# Altium schematic sheet CPLD.SchDoc: {Наименование}
size 420 x 297 mm; DocumentNumber: НРДЦ.ХХХХХХ.ХХХ ХХ; SheetNumber: {}; SheetTotal: {}; PageSetup: Record=PageOptions|CenterHorizontal=False|CenterVertical=False|PrintScale=0.95|XCorrection=0.00|YCorrection=0.00|PrintKind=1|BorderSize=5000000|LeftOffset=0|BottomOffset=0|Orientation=1|PaperLength=1000|PaperWidth=1000|Scale=100|PaperSource=15|PrintQuality=600|MediaType=1|DitherType=10|PaperKind=A4|PrintScaleMode=1; Rule: PcbType=ProtelPcb
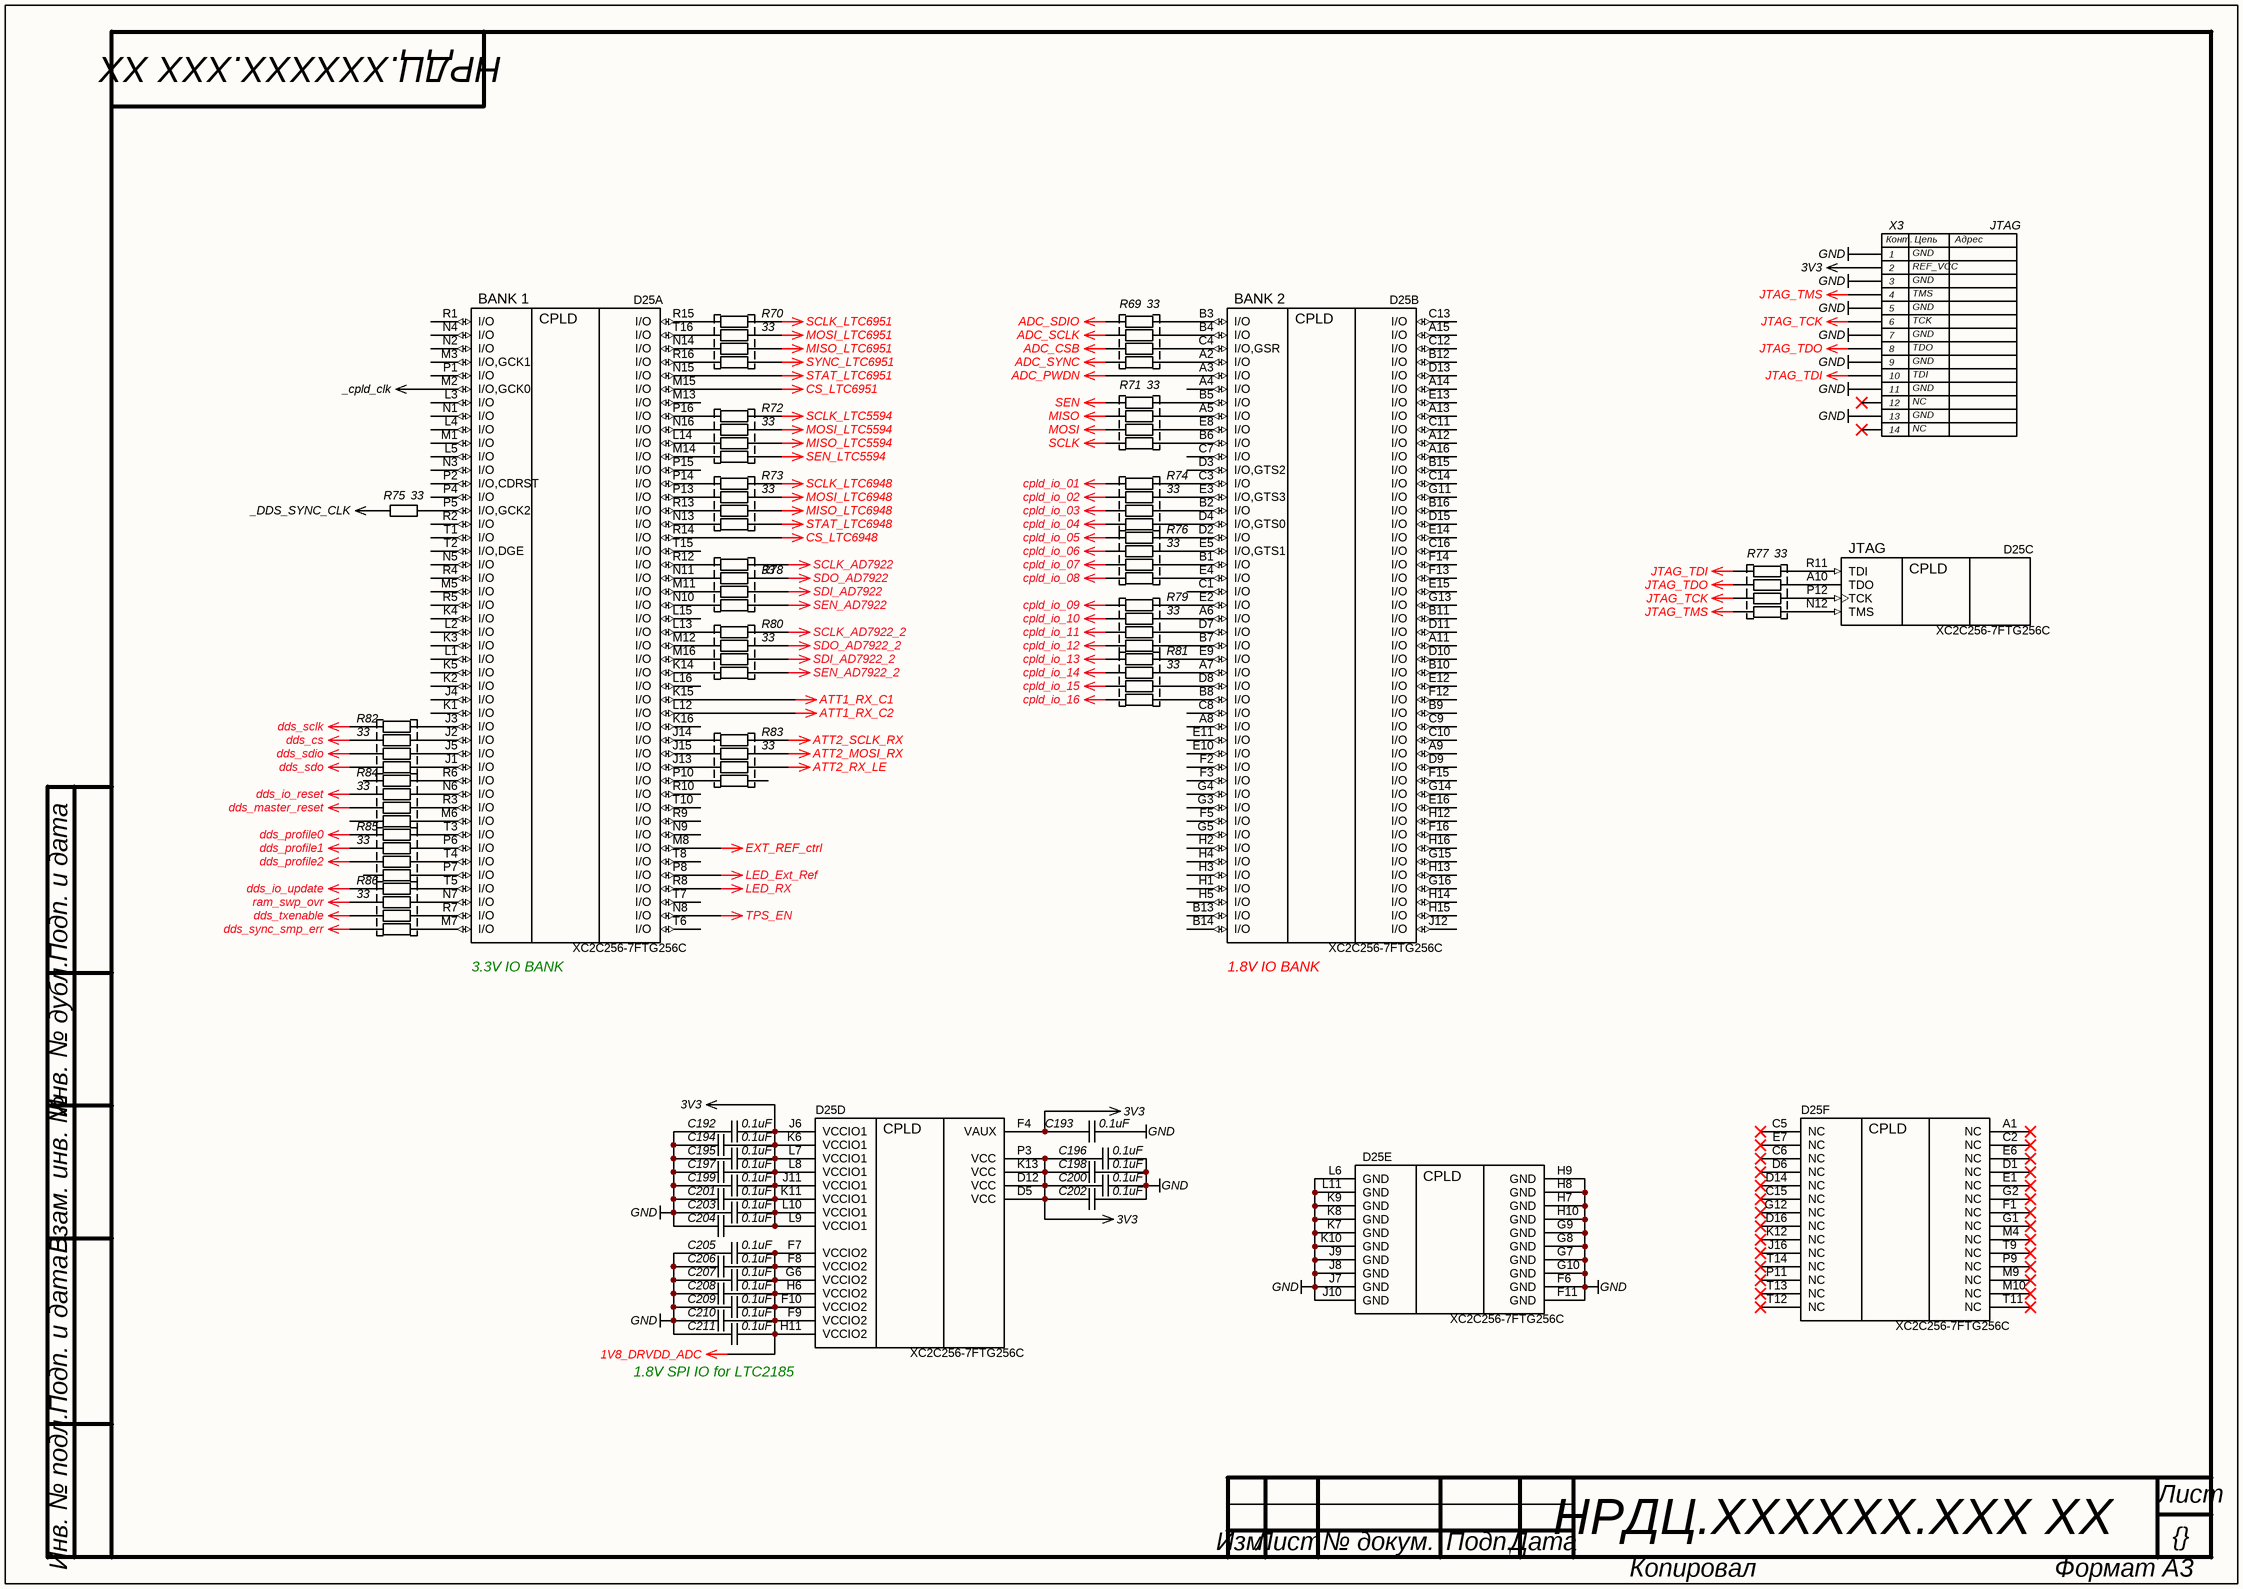
[diagram p0: CPLD.SchDoc]

## Parts
C192  value 0.1uF  [C0402]  (hidden comment: CAP)
C193  value 0.1uF  [C0402]  (hidden comment: CAP)
C194  value 0.1uF  [C0402]  (hidden comment: CAP)
C195  value 0.1uF  [C0402]  (hidden comment: CAP)
C196  value 0.1uF  [C0402]  (hidden comment: CAP)
C197  value 0.1uF  [C0402]  (hidden comment: CAP)
C198  value 0.1uF  [C0402]  (hidden comment: CAP)
C199  value 0.1uF  [C0402]  (hidden comment: CAP)
C200  value 0.1uF  [C0402]  (hidden comment: CAP)
C201  value 0.1uF  [C0402]  (hidden comment: CAP)
C202  value 0.1uF  [C0402]  (hidden comment: CAP)
C203  value 0.1uF  [C0402]  (hidden comment: CAP)
C204  value 0.1uF  [C0402]  (hidden comment: CAP)
C205  value 0.1uF  [C0402]  (hidden comment: CAP)
C206  value 0.1uF  [C0402]  (hidden comment: CAP)
C207  value 0.1uF  [C0402]  (hidden comment: CAP)
C208  value 0.1uF  [C0402]  (hidden comment: CAP)
C209  value 0.1uF  [C0402]  (hidden comment: CAP)
C210  value 0.1uF  [C0402]  (hidden comment: CAP)
C211  value 0.1uF  [C0402]  (hidden comment: CAP)
D25  XC2C256-7FTG256C  [FTG256]  (parts A,B,C,D,E,F of 6)
R69  value 33  [EXN8V]  (hidden comment: RES 4x0402)
R70  value 33  [EXN8V]  (hidden comment: RES 4x0402)
R71  value 33  [EXN8V]  (hidden comment: RES 4x0402)
R72  value 33  [EXN8V]  (hidden comment: RES 4x0402)
R73  value 33  [EXN8V]  (hidden comment: RES 4x0402)
R74  value 33  [EXN8V]  (hidden comment: RES 4x0402)
R75  value 33  [R0402]  (hidden comment: RES)
R76  value 33  [EXN8V]  (hidden comment: RES 4x0402)
R77  value 33  [EXN8V]  (hidden comment: RES 4x0402)
R78  value 33  [EXN8V]  (hidden comment: RES 4x0402)
R79  value 33  [EXN8V]  (hidden comment: RES 4x0402)
R80  value 33  [EXN8V]  (hidden comment: RES 4x0402)
R81  value 33  [EXN8V]  (hidden comment: RES 4x0402)
R82  value 33  [EXN8V]  (hidden comment: RES 4x0402)
R83  value 33  [EXN8V]  (hidden comment: RES 4x0402)
R84  value 33  [EXN8V]  (hidden comment: RES 4x0402)
R85  value 33  [EXN8V]  (hidden comment: RES 4x0402)
R86  value 33  [EXN8V]  (hidden comment: RES 4x0402)
X3  JTAG  [JTAG Mail 2mm]

## Nets
1V8_DRVDD_ADC: C205.2 C206.2 C207.2 C208.2 C209.2 C210.2 C211.2 D25.F7(VCCIO2) D25.F8(VCCIO2) D25.F9(VCCIO2) D25.F10(VCCIO2) D25.G6(VCCIO2) D25.H6(VCCIO2) D25.H11(VCCIO2)
3V3: C192.2 C193.1 C194.2 C195.2 C196.1 C197.2 C198.1 C199.2 C200.1 C201.2 C202.1 C203.2 C204.2 D25.D5(VCC) D25.D12(VCC) D25.F4(VAUX) D25.J6(VCCIO1) D25.J11(VCCIO1) D25.K6(VCCIO1) D25.K11(VCCIO1) D25.K13(VCC) D25.L7(VCCIO1) D25.L8(VCCIO1) D25.L9(VCCIO1) D25.L10(VCCIO1) D25.P3(VCC) X3.2
_cpld_clk: D25.M2(I/O,GCK0)
_DDS_SYNC_CLK: R75.1
ADC_CSB: R69.7
ADC_PWDN: D25.A3(I/O)
ADC_SCLK: R69.6
ADC_SDIO: R69.5
ADC_SYNC: R69.8
ATT1_RX_C1: D25.K15(I/O)
ATT1_RX_C2: D25.L12(I/O)
ATT2_MOSI_RX: R83.3
ATT2_RX_LE: R83.2
ATT2_SCLK_RX: R83.4
cpld_io_01: R74.5
cpld_io_02: R74.6
cpld_io_03: R74.7
cpld_io_04: R74.8
cpld_io_05: R76.5
cpld_io_06: R76.6
cpld_io_07: R76.7
cpld_io_08: R76.8
cpld_io_09: R79.5
cpld_io_10: R79.6
cpld_io_11: R79.7
cpld_io_12: R79.8
cpld_io_13: R81.5
cpld_io_14: R81.6
cpld_io_15: R81.7
cpld_io_16: R81.8
CS_LTC6948: D25.R14(I/O)
CS_LTC6951: D25.M15(I/O)
dds_cs: R82.6
dds_io_reset: R84.6
dds_io_update: R86.5
dds_master_reset: R84.7
dds_profile0: R85.5
dds_profile1: R85.6
dds_profile2: R85.7
dds_sclk: R82.5
dds_sdio: R82.7
dds_sdo: R82.8
dds_sync_smp_err: R86.8
dds_txenable: R86.7
EXT_REF_ctrl: D25.M8(I/O)
GND: C192.1 C193.2 C194.1 C195.1 C196.2 C197.1 C198.2 C199.1 C200.2 C201.1 C202.2 C203.1 C204.1 C205.1 C206.1 C207.1 C208.1 C209.1 C210.1 C211.1 D25.F6(GND) D25.F11(GND) D25.G7(GND) D25.G8(GND) D25.G9(GND) D25.G10(GND) D25.H7(GND) D25.H8(GND) D25.H9(GND) D25.H10(GND) D25.J7(GND) D25.J8(GND) D25.J9(GND) D25.J10(GND) D25.K7(GND) D25.K8(GND) D25.K9(GND) D25.K10(GND) D25.L6(GND) D25.L11(GND) X3.1 X3.3 X3.5 X3.7 X3.9 X3.11 X3.13
JTAG_TCK: R77.7 X3.6
JTAG_TDI: R77.5 X3.10
JTAG_TDO: R77.6 X3.8
JTAG_TMS: R77.8 X3.4
LED_Ext_Ref: D25.P8(I/O)
LED_RX: D25.R8(I/O)
MISO: R71.6
MISO_LTC5594: R72.2
MISO_LTC6948: R73.2
MISO_LTC6951: R70.2
MOSI: R71.7
MOSI_LTC5594: R72.3
MOSI_LTC6948: R73.3
MOSI_LTC6951: R70.3
ram_swp_ovr: R86.6
SCLK: R71.8
SCLK_AD7922: R78.4
SCLK_AD7922_2: R80.4
SCLK_LTC5594: R72.4
SCLK_LTC6948: R73.4
SCLK_LTC6951: R70.4
SDI_AD7922: R78.2
SDI_AD7922_2: R80.2
SDO_AD7922: R78.3
SDO_AD7922_2: R80.3
SEN: R71.5
SEN_AD7922: R78.1
SEN_AD7922_2: R80.1
SEN_LTC5594: R72.1
STAT_LTC6948: R73.1
STAT_LTC6951: D25.N15(I/O)
SYNC_LTC6951: R70.1
TPS_EN: D25.N8(I/O)
NetD25_A2: D25.A2(I/O) R69.1
NetD25_A5: D25.A5(I/O) R71.3
NetD25_A6: D25.A6(I/O) R79.3
NetD25_A7: D25.A7(I/O) R81.3
NetD25_A10: D25.A10(TDO) R77.3
NetD25_B1: D25.B1(I/O) R76.2
NetD25_B2: D25.B2(I/O) R74.2
NetD25_B3: D25.B3(I/O) R69.4
NetD25_B4: D25.B4(I/O) R69.3
NetD25_B5: D25.B5(I/O) R71.4
NetD25_B6: D25.B6(I/O) R71.1
NetD25_B7: D25.B7(I/O) R79.1
NetD25_B8: D25.B8(I/O) R81.1
NetD25_C3: D25.C3(I/O) R74.4
NetD25_C4: D25.C4(I/O,GSR) R69.2
NetD25_D2: D25.D2(I/O) R76.4
NetD25_D4: D25.D4(I/O,GTS0) R74.1
NetD25_D7: D25.D7(I/O) R79.2
NetD25_D8: D25.D8(I/O) R81.2
NetD25_E2: D25.E2(I/O) R79.4
NetD25_E3: D25.E3(I/O,GTS3) R74.3
NetD25_E4: D25.E4(I/O) R76.1
NetD25_E5: D25.E5(I/O,GTS1) R76.3
NetD25_E8: D25.E8(I/O) R71.2
NetD25_E9: D25.E9(I/O) R81.4
NetD25_J1: D25.J1(I/O) R82.1
NetD25_J2: D25.J2(I/O) R82.3
NetD25_J3: D25.J3(I/O) R82.4
NetD25_J5: D25.J5(I/O) R82.2
NetD25_J13: D25.J13(I/O) R83.7
NetD25_J14: D25.J14(I/O) R83.5
NetD25_J15: D25.J15(I/O) R83.6
NetD25_K14: D25.K14(I/O) R80.8
NetD25_L13: D25.L13(I/O) R80.5
NetD25_L14: D25.L14(I/O) R72.7
NetD25_M6: D25.M6(I/O) R84.1
NetD25_M7: D25.M7(I/O) R86.1
NetD25_M11: D25.M11(I/O) R78.7
NetD25_M12: D25.M12(I/O) R80.6
NetD25_M14: D25.M14(I/O) R72.8
NetD25_M16: D25.M16(I/O) R80.7
NetD25_N6: D25.N6(I/O) R84.3
NetD25_N7: D25.N7(I/O) R86.3
NetD25_N10: D25.N10(I/O) R78.8
NetD25_N11: D25.N11(I/O) R78.6
NetD25_N12: D25.N12(TMS) R77.1
NetD25_N13: D25.N13(I/O) R73.8
NetD25_N14: D25.N14(I/O) R70.7
NetD25_N16: D25.N16(I/O) R72.6
NetD25_P5: D25.P5(I/O,GCK2) R75.2
NetD25_P6: D25.P6(I/O) R85.3
NetD25_P7: D25.P7(I/O) R85.1
NetD25_P10: D25.P10(I/O) R83.8
NetD25_P12: D25.P12(TCK) R77.2
NetD25_P13: D25.P13(I/O) R73.6
NetD25_P14: D25.P14(I/O) R73.5
NetD25_P16: D25.P16(I/O) R72.5
NetD25_R3: D25.R3(I/O) R84.2
NetD25_R6: D25.R6(I/O) R84.4
NetD25_R7: D25.R7(I/O) R86.2
NetD25_R11: D25.R11(TDI) R77.4
NetD25_R12: D25.R12(I/O) R78.5
NetD25_R13: D25.R13(I/O) R73.7
NetD25_R15: D25.R15(I/O) R70.5
NetD25_R16: D25.R16(I/O) R70.8
NetD25_T3: D25.T3(I/O) R85.4
NetD25_T4: D25.T4(I/O) R85.2
NetD25_T5: D25.T5(I/O) R86.4
NetD25_T16: D25.T16(I/O) R70.6

Not connected (* = marked no-connect by the designer): D25 A1(NC)* A4(I/O) A8(I/O) A9(I/O) A11(I/O) A12(I/O) A13(I/O) A14(I/O) A15(I/O) A16(I/O) B9(I/O) B10(I/O) B11(I/O) B12(I/O) B13(I/O) B14(I/O) B15(I/O) B16(I/O) C1(I/O) C2(NC)* C5(NC)* C6(NC)* C7(I/O) C8(I/O) C9(I/O) C10(I/O) C11(I/O) C12(I/O) C13(I/O) C14(I/O) C15(NC)* C16(I/O) D1(NC)* D3(I/O,GTS2) D6(NC)* D9(I/O) D10(I/O) D11(I/O) D13(I/O) D14(NC)* D15(I/O) D16(NC)* E1(NC)* E6(NC)* E7(NC)* E10(I/O) E11(I/O) E12(I/O) E13(I/O) E14(I/O) E15(I/O) E16(I/O) F1(NC)* F2(I/O) F3(I/O) F5(I/O) F12(I/O) F13(I/O) F14(I/O) F15(I/O) F16(I/O) G1(NC)* G2(NC)* G3(I/O) G4(I/O) G5(I/O) G11(I/O) G12(NC)* G13(I/O) G14(I/O) G15(I/O) G16(I/O) H1(I/O) H2(I/O) H3(I/O) H4(I/O) H5(I/O) H12(I/O) H13(I/O) H14(I/O) H15(I/O) H16(I/O) J4(I/O) J12(I/O) J16(NC)* K1(I/O) K2(I/O) K3(I/O) K4(I/O) K5(I/O) K12(NC)* K16(I/O) L1(I/O) L2(I/O) L3(I/O) L4(I/O) L5(I/O) L15(I/O) L16(I/O) M1(I/O) M3(I/O,GCK1) M4(NC)* M5(I/O) M9(NC)* M10(NC)* M13(I/O) N1(I/O) N2(I/O) N3(I/O) N4(I/O) N5(I/O) N9(I/O) P1(I/O) P2(I/O,CDRST) P4(I/O) P9(NC)* P11(NC)* P15(I/O) R1(I/O) R2(I/O) R4(I/O) R5(I/O) R9(I/O) R10(I/O) T1(I/O) T2(I/O,DGE) T6(I/O) T7(I/O) T8(I/O) T9(NC)* T10(I/O) T11(NC)* T12(NC)* T13(NC)* T14(NC)* T15(I/O); R83 1; R84 5 8; R85 8; X3 12* 14*

## Notes on the sheet
- (near X3) GND
- (near X3) REF_VCC
- (near X3) TMS
- (near X3) TCK
- (near X3) TDO
- (near X3) TDI
- (near X3) NC
- (near D25) 3.3V IO BANK
- (near D25) 1.8V IO BANK
- 1.8V SPI IO for LTC2185
- Подп. и дата
- Инв. № дубл.
- Взам. инв. №
- Инв. № подл.
- Лист
- Изм.
- № докум.
- Подп.
- Дата
- Копировал
- Формат А3
- (in symbol HDR Debug_14-pin) Конт.; Цепь; Адрес
- (in symbol XC2C256-7FTG256C, part A) BANK 1
- (in symbol XC2C256-7FTG256C, part B) BANK 2
- (in symbol XC2C256-7FTG256C, part C) JTAG

## Library data of the parts
C192-C211 = CAP: SMD Capacitor; Manufacturer: Murata; Material: X7R; Tolerance: 10%; Voltage: 16V; Type: Ceramic Capacitor; P/N: GRM155R71C104KA88J
D25 = XC2C256-7FTG256C: CoolRunner-II 1.8V, 256 Macrocell CPLD, 184 User I/Os, 256-Ball FTBGA, Commercial Grade, Pb-Free; Code_JEDEC: MS-034-AAF-1*; PackageVersion: ver1.3, Oct-2007; PackageReference: FTG256; PackageDescription: 256-Ball Fine Pitch Thin Ball Grid Array 1.00 mm Pitch (FTG256) - Pb-Free; DatasheetVersion: ver3.2, Mar-2007; PartNumber: XC2C256-7FTG256C; P/N: XC2C256-7FTG256C; Name: XC2C256-7FTG256C; Type: CPLD
R69-R74 R76-R86 = RES 4x0402: Chip Resistor Array; Manufacturer: Panasonic; Name: EXBN8V; Number of Resistors: 4; Tolerance: 5%; P/N: ERJ-2GEJ330X; Type: 0402 Array Concave Terminal; Number of Terminals: 8; Series: EXB
R75 = RES: SMD Resistor; Name: Chip SMD Resistor; Power: 0.062 Wt; Tolerance: 5%; P/N: ERJ-2GEJ330X; Temperature Range: -55…155°C
X3 = HDR Debug_14-pin: 2.00mm Pitch, Milli-Grid PCB Header, Dual Row, Vertical, Through Hole, Shrouded, 14 / Circuits; Manufacturer: Molex; Name: Milli-Grid Connector System; P/N: 878311421; Type: 2.00mm Pitch, Milli-Grid PCB Header, Dual Row, Vertical, Through Hole, Shrouded, 14; Series: 87831